# Altium schematic sheet 1_P1.schdoc
size 309 x 223 mm; Symbol: Sheet-Symbol_A4; Device: Sheet-Symbol_A4; Company: EasyEDA.com; Drawed: EasyEDA Pro; Reviewed: EasyEDA Pro; Version: V0.1; Page Size: A4; @Project Name: TUD-EnergyHarvestingConsole_2022-08-29_17-01-09; @Page Count: 1; @Update Date: 2023-02-03; @Create Date: 2023-02-03; @Schematic Name: Schematic3; Part Number: JLCPCB-002; @Page No: 1; @Page Name: P1
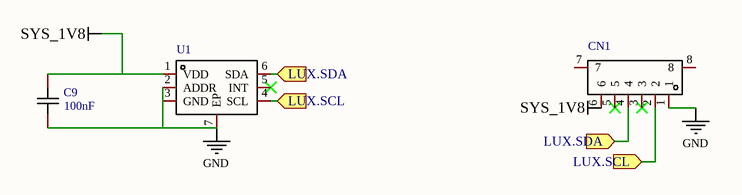
[diagram p0: 1_P1.schdoc]

## Parts
C9  100nF  [C0603]
CN1  532610671  [CONN-SMD_6P-P1.25_53261-0671]  (value not drawn)
U1  OPT3001DNPR  [USON6_L2.1-W2.1-P0.65-BL-EP]  (value not drawn)

## Ports
LUX.SCL (in), LUX.SDA (in)

## Nets
GND: C9.2 CN1.1 U1.2(ADDR) U1.3(GND) U1.7(EP)
SYS_1V8: C9.1 CN1.6 U1.1(VDD)
LUX.SCL: CN1.2 U1.4(SCL) ; port LUX.SCL
LUX.SDA: CN1.4 U1.6(SDA) ; port LUX.SDA

Not connected (* = marked no-connect by the designer): CN1 3* 5* 7 8; U1 5(INT)*

## Notes on the sheet
- 1
- 2
- 3
- 4
- 5
- 6
- A
- B
- C
- Schematic
- Schematic3
- Create Date
- Update Date
- 2023-02-03
- Reviewed
- Drawed
- Page
- EasyEDA Pro
- P1
- Part Number
- TUD-EnergyHarvestingConsole_2022-08-29_17-01-09
- JLCPCB-002
- D
- VER
- SIZE
- PAGE
- OF
- V0.1
- A4
- EasyEDA.com

## Library data of the parts
C9 = CC0603KRX7R9BB104: Manufacturer: YAGEO; Convert to PCB: yes; Name: 100nF; Symbol: 100nF; Device: CC0603KRX7R9BB104; Supplier: LCSC; Manufacturer Part: CC0603KRX7R9BB104; Supplier Part: C14663; JLCPCB Part Class: Basic; Add into BOM: yes; Origin Footprint: C0603
CN1 = 532610671: Reference Series:- Pitch:1.25mm Pins Structure:1x6P Number of Rows:1 Number of PINs Per Row:6 Row Spacing:- Mounting Style:- Contact Material:bronze; Manufacturer: MOLEX; Symbol: 53261-0671; Add into BOM: yes; Pitch: 1.25mm; Pins Structure: 1x6P; Number of PINs Per Row: 6; Name: 532610671; Device: 532610671; LCSC Part Name: 1.25mm 1x6P; Supplier Part: C99277; Manufacturer Part: 532610671; Supplier Footprint: -; JLCPCB Part Class: Extended Part; Datasheet: https://atta.szlcsc.com/upload/public/pdf/source/20180713/C99277_7A4A98FEF11A2209B5FFC17F14BF7E54.pdf; Supplier: LCSC; Convert to PCB: yes; Reference Series: -; Number of Rows: 1; Row Spacing: -; Mounting Style: -; Contact Material: bronze
U1 = OPT3001DNPR: Manufacturer: TI(德州仪器); Add into BOM: yes; Name: OPT3001DNPR; Symbol: OPT3001DNPR; Device: OPT3001DNPR; LCSC Part Name: OPT3001DNPR; Supplier Part: C90462; Manufacturer Part: OPT3001DNPR; Supplier Footprint: USON6-EP(2.1x2.1); JLCPCB Part Class: Extended Part; Datasheet: https://atta.szlcsc.com/upload/public/pdf/source/20161217/1481939167882.pdf; Supplier: LCSC; Convert to PCB: yes